# Altium schematic sheet TemperatureSensorBlock.SchDoc: Temperature Sensor Block
size A3; Date: 7/13/2012; ApprovedBy: Levi Balling; CheckedBy: Dell Hanks; Author: Levi Balling; CompanyName: Smart Home; DrawnBy: Levi Balling; Engineer: Levi Balling; Organization: Smart Home; Address1: University of Utah; DocumentNumber: 1; Revision: 1; SheetNumber: 1; SheetTotal: 1; CurrentDate: 7/13/2012; DocumentName: Temperature Sensor Block; ProjectName: Smart Home
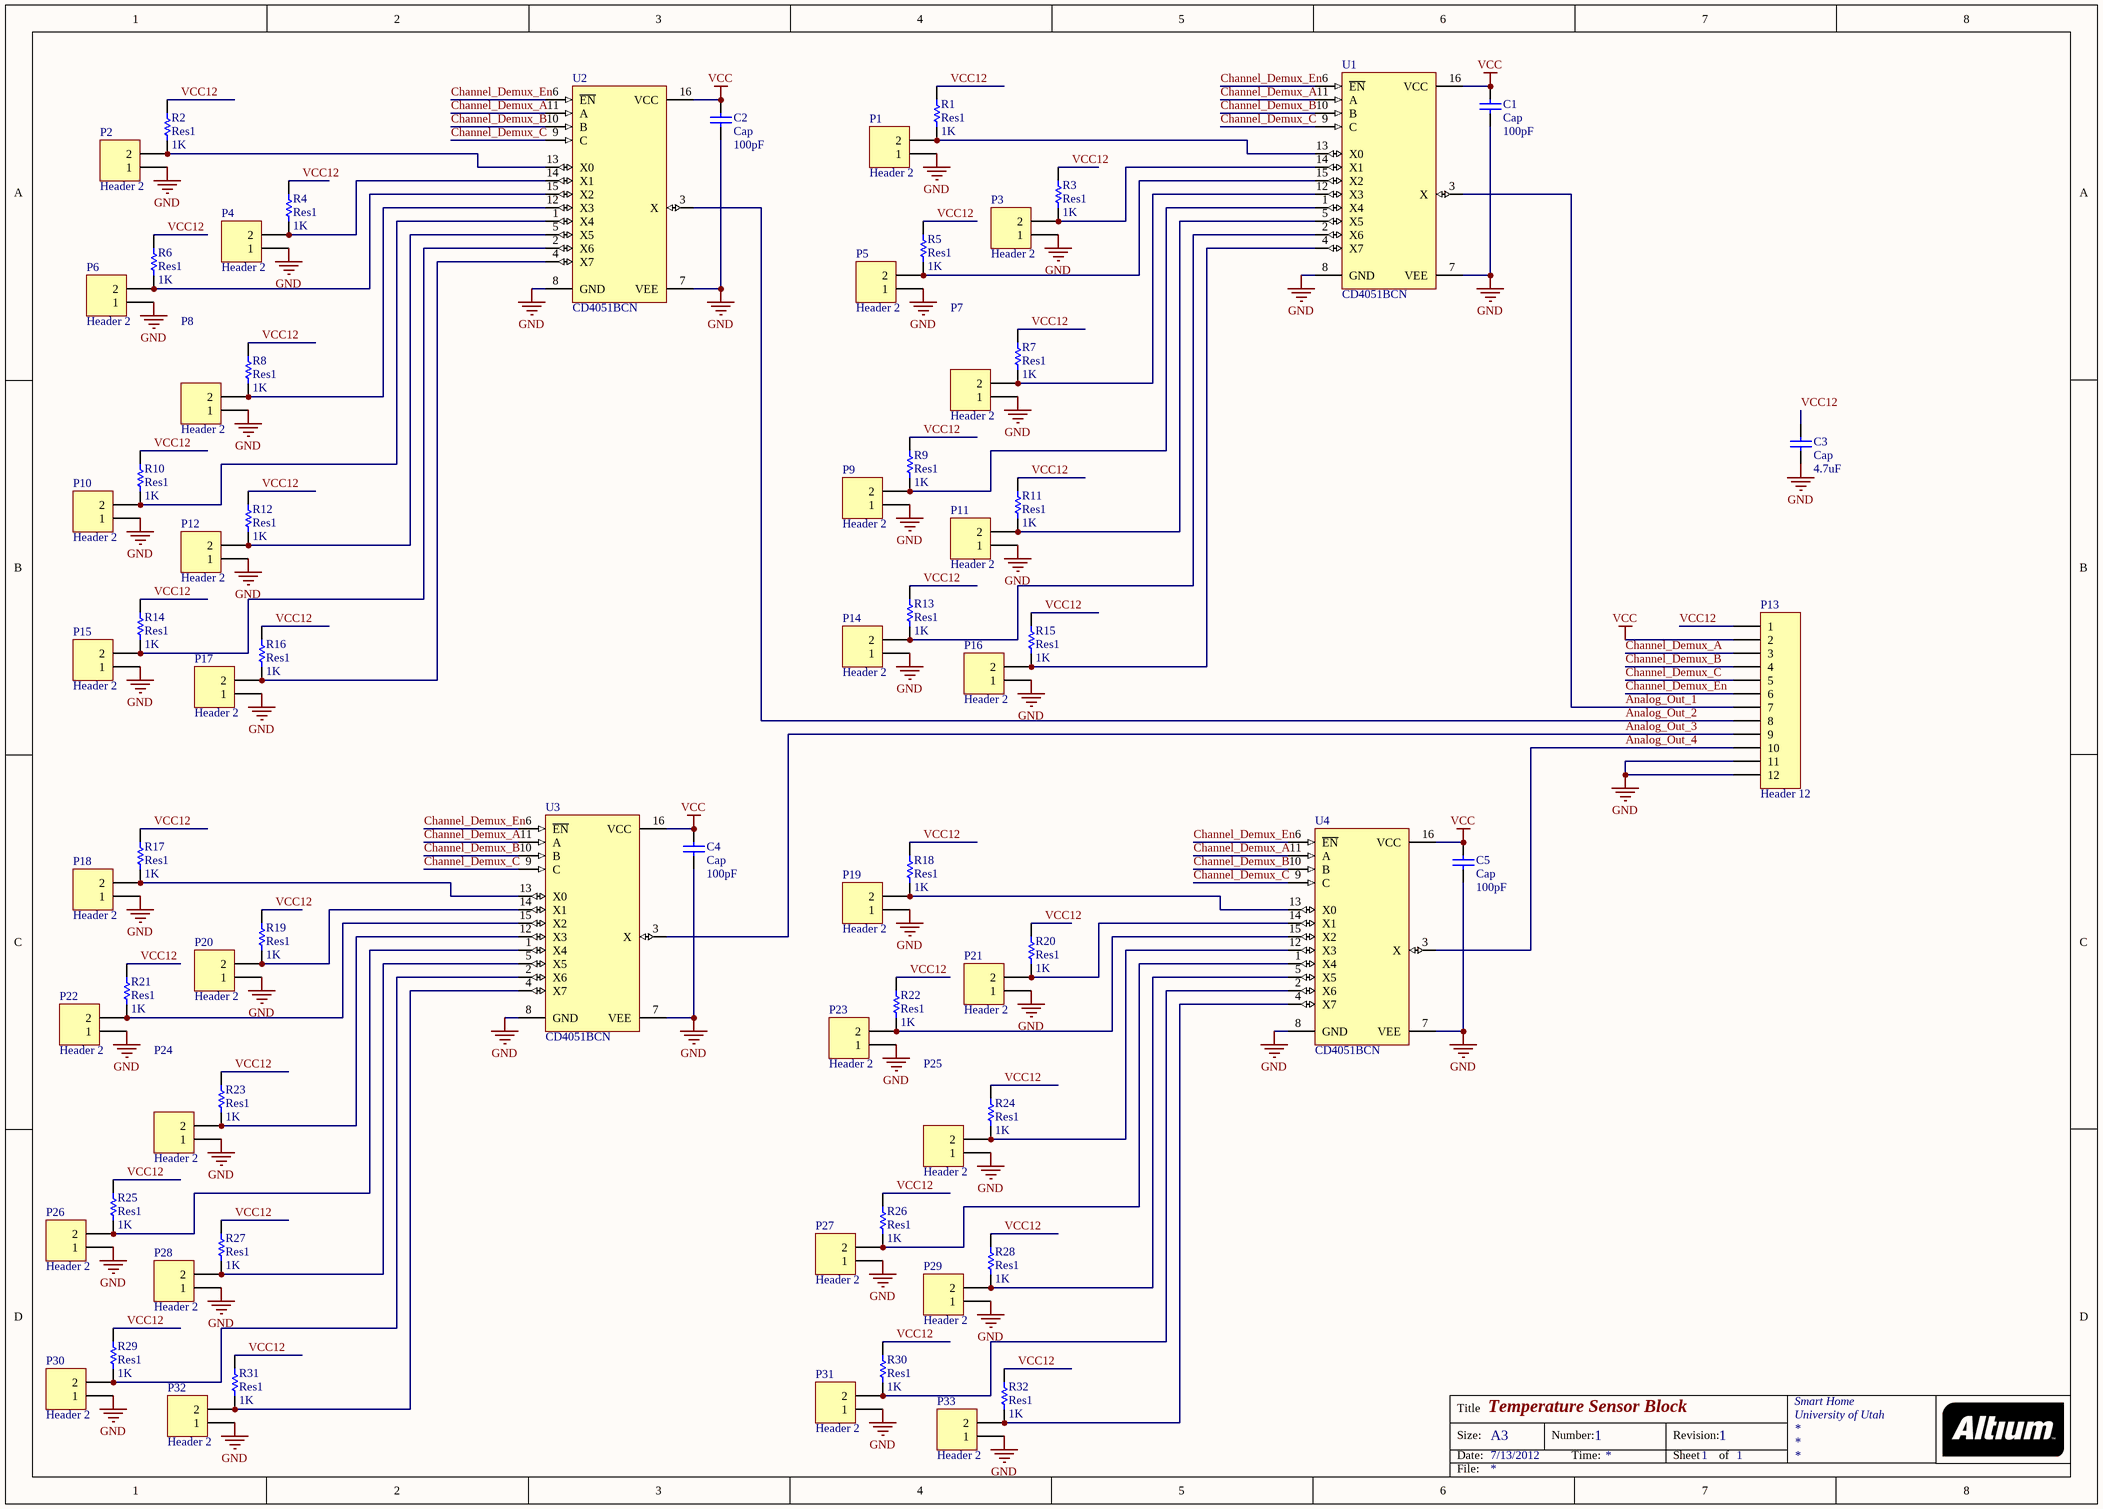
[diagram p0: TemperatureSensorBlock.SchDoc]

## Parts
C1  Cap  value 100pF  [RAD-0.3]
C2  Cap  value 100pF  [RAD-0.3]
C3  Cap  value 4.7uF  [RAD-0.3]
C4  Cap  value 100pF  [RAD-0.3]
C5  Cap  value 100pF  [RAD-0.3]
P1  Header 2  [HDR1X2]
P2  Header 2  [HDR1X2]
P3  Header 2  [HDR1X2]
P4  Header 2  [HDR1X2]
P5  Header 2  [HDR1X2]
P6  Header 2  [HDR1X2]
P7  Header 2  [HDR1X2]
P8  Header 2  [HDR1X2]
P9  Header 2  [HDR1X2]
P10  Header 2  [HDR1X2]
P11  Header 2  [HDR1X2]
P12  Header 2  [HDR1X2]
P13  Header 12  [HDR1X12]
P14  Header 2  [HDR1X2]
P15  Header 2  [HDR1X2]
P16  Header 2  [HDR1X2]
P17  Header 2  [HDR1X2]
P18  Header 2  [HDR1X2]
P19  Header 2  [HDR1X2]
P20  Header 2  [HDR1X2]
P21  Header 2  [HDR1X2]
P22  Header 2  [HDR1X2]
P23  Header 2  [HDR1X2]
P24  Header 2  [HDR1X2]
P25  Header 2  [HDR1X2]
P26  Header 2  [HDR1X2]
P27  Header 2  [HDR1X2]
P28  Header 2  [HDR1X2]
P29  Header 2  [HDR1X2]
P30  Header 2  [HDR1X2]
P31  Header 2  [HDR1X2]
P32  Header 2  [HDR1X2]
P33  Header 2  [HDR1X2]
R1  Res1  value 1K  [AXIAL-0.3]
R2  Res1  value 1K  [AXIAL-0.3]
R3  Res1  value 1K  [AXIAL-0.3]
R4  Res1  value 1K  [AXIAL-0.3]
R5  Res1  value 1K  [AXIAL-0.3]
R6  Res1  value 1K  [AXIAL-0.3]
R7  Res1  value 1K  [AXIAL-0.3]
R8  Res1  value 1K  [AXIAL-0.3]
R9  Res1  value 1K  [AXIAL-0.3]
R10  Res1  value 1K  [AXIAL-0.3]
R11  Res1  value 1K  [AXIAL-0.3]
R12  Res1  value 1K  [AXIAL-0.3]
R13  Res1  value 1K  [AXIAL-0.3]
R14  Res1  value 1K  [AXIAL-0.3]
R15  Res1  value 1K  [AXIAL-0.3]
R16  Res1  value 1K  [AXIAL-0.3]
R17  Res1  value 1K  [AXIAL-0.3]
R18  Res1  value 1K  [AXIAL-0.3]
R19  Res1  value 1K  [AXIAL-0.3]
R20  Res1  value 1K  [AXIAL-0.3]
R21  Res1  value 1K  [AXIAL-0.3]
R22  Res1  value 1K  [AXIAL-0.3]
R23  Res1  value 1K  [AXIAL-0.3]
R24  Res1  value 1K  [AXIAL-0.3]
R25  Res1  value 1K  [AXIAL-0.3]
R26  Res1  value 1K  [AXIAL-0.3]
R27  Res1  value 1K  [AXIAL-0.3]
R28  Res1  value 1K  [AXIAL-0.3]
R29  Res1  value 1K  [AXIAL-0.3]
R30  Res1  value 1K  [AXIAL-0.3]
R31  Res1  value 1K  [AXIAL-0.3]
R32  Res1  value 1K  [AXIAL-0.3]
U1  CD4051BCN  [N16E]
U2  CD4051BCN  [N16E]
U3  CD4051BCN  [N16E]
U4  CD4051BCN  [N16E]

## Nets
GND: C1.1 C2.1 C3.1 C4.1 C5.1 P1.1 P2.1 P3.1 P4.1 P5.1 P6.1 P7.1 P8.1 P9.1 P10.1 P11.1 P12.1 P13.11 P13.12 P14.1 P15.1 P16.1 P17.1 P18.1 P19.1 P20.1 P21.1 P22.1 P23.1 P24.1 P25.1 P26.1 P27.1 P28.1 P29.1 P30.1 P31.1 P32.1 P33.1 U1.7(VEE) U1.8(GND) U2.7(VEE) U2.8(GND) U3.7(VEE) U3.8(GND) U4.7(VEE) U4.8(GND)
VCC: C1.2 C2.2 C4.2 C5.2 P13.2 U1.16(VCC) U2.16(VCC) U3.16(VCC) U4.16(VCC)
Analog_Out_1: P13.7 U1.3(X)
Analog_Out_2: P13.8 U2.3(X)
Analog_Out_3: P13.9 U3.3(X)
Analog_Out_4: P13.10 U4.3(X)
Channel_Demux_A: P13.3 U1.11(A) U2.11(A) U3.11(A) U4.11(A)
Channel_Demux_B: P13.4 U1.10(B) U2.10(B) U3.10(B) U4.10(B)
Channel_Demux_C: P13.5 U1.9(C) U2.9(C) U3.9(C) U4.9(C)
Channel_Demux_En: P13.6 U1.6(~{EN}) U2.6(~{EN}) U3.6(~{EN}) U4.6(~{EN})
VCC12: C3.2 P13.1 R1.2 R2.2 R3.2 R4.2 R5.2 R6.2 R7.2 R8.2 R9.2 R10.2 R11.2 R12.2 R13.2 R14.2 R15.2 R16.2 R17.2 R18.2 R19.2 R20.2 R21.2 R22.2 R23.2 R24.2 R25.2 R26.2 R27.2 R28.2 R29.2 R30.2 R31.2 R32.2
NetP1_2: P1.2 R1.1 U1.13(X0)
NetP2_2: P2.2 R2.1 U2.13(X0)
NetP3_2: P3.2 R3.1 U1.14(X1)
NetP4_2: P4.2 R4.1 U2.14(X1)
NetP5_2: P5.2 R5.1 U1.15(X2)
NetP6_2: P6.2 R6.1 U2.15(X2)
NetP7_2: P7.2 R7.1 U1.12(X3)
NetP8_2: P8.2 R8.1 U2.12(X3)
NetP9_2: P9.2 R9.1 U1.1(X4)
NetP10_2: P10.2 R10.1 U2.1(X4)
NetP11_2: P11.2 R11.1 U1.5(X5)
NetP12_2: P12.2 R12.1 U2.5(X5)
NetP14_2: P14.2 R13.1 U1.2(X6)
NetP15_2: P15.2 R14.1 U2.2(X6)
NetP16_2: P16.2 R15.1 U1.4(X7)
NetP17_2: P17.2 R16.1 U2.4(X7)
NetP18_2: P18.2 R17.1 U3.13(X0)
NetP19_2: P19.2 R18.1 U4.13(X0)
NetP20_2: P20.2 R19.1 U3.14(X1)
NetP21_2: P21.2 R20.1 U4.14(X1)
NetP22_2: P22.2 R21.1 U3.15(X2)
NetP23_2: P23.2 R22.1 U4.15(X2)
NetP24_2: P24.2 R23.1 U3.12(X3)
NetP25_2: P25.2 R24.1 U4.12(X3)
NetP26_2: P26.2 R25.1 U3.1(X4)
NetP27_2: P27.2 R26.1 U4.1(X4)
NetP28_2: P28.2 R27.1 U3.5(X5)
NetP29_2: P29.2 R28.1 U4.5(X5)
NetP30_2: P30.2 R29.1 U3.2(X6)
NetP31_2: P31.2 R30.1 U4.2(X6)
NetP32_2: P32.2 R31.1 U3.4(X7)
NetP33_2: P33.2 R32.1 U4.4(X7)

## Notes on the sheet
- Title
- Size:
- Date:
- A3
- Number:
- Time:
- Revision:
- Sheet
- of
- File:

## Library data of the parts
C1-C5 = Cap: Capacitor; Published: 8-Jun-2000; LatestRevisionDate: 17-Jul-2002; LatestRevisionNote: Re-released for DXP Platform.; PackageReference: RAD-0.3; Publisher: Altium Limited; PackageDescription: Radial Cap, Thru-Hole; 2 Leads; 0.3 in Pin Spacing
P1-P12 P14-P33 = Header 2: Header, 2-Pin; LatestRevisionDate: 17-Jul-2002; LatestRevisionNote: Re-released for DXP Platform.; Publisher: Altium Limited
P13 = Header 12: Header, 12-Pin; LatestRevisionDate: 17-Jul-2002; LatestRevisionNote: Re-released for DXP Platform.; Publisher: Altium Limited
R1-R32 = Res1: Resistor; Published: 8-Jun-2000; LatestRevisionDate: 17-Jul-2002; LatestRevisionNote: Re-released for DXP Platform.; PackageReference: AXIAL-0.3; Publisher: Altium Limited; PackageDescription: Axial Device, Thru-Hole; 2 Leads; 0.3 in Pin Spacing
U1-U4 = CD4051BCN: 8-Channel Analog Multiplexer/Demultiplexer; Published: 17-Jul-2002; LatestRevisionDate: 29-May-2009; LatestRevisionNote: Component Body Added.; DatasheetVersion: Jan-1999; PackageVersion: 2000; PackageReference: N16E; Publisher: Altium Limited; PackageDescription: DIP, 16-Pin, Row Spacing 7.62 mm, Pitch 2.54 mm; ComponentLink1Description: Manufacturer Link; ComponentLink1URL: http://www.fairchildsemi.com/; ComponentLink2Description: Datasheet; ComponentLink2URL: http://www.fairchildsemi.com/ds/CD%2FCD4052BC.pdf